# Altium schematic sheet PongBoy.SchDoc
size A4; CompanyName: HESSO; Address1: Route du Rawyl 47; Address2: 1950 Sion; Address3: Switzerland; PageSetup: Record=PageOptions|CenterHorizontal=True|CenterVertical=True|PrintScale=1.00|XCorrection=1.00|YCorrection=1.00|PrintKind=1|BorderSize=5000000|LeftOffset=0|BottomOffset=0|Orientation=2|PaperLength=1000|PaperWidth=1000|Scale=100|PaperSource=15|PrintQuality=1200|MediaType=1|DitherType=10|PrintScaleMode=1|PaperKind=A4|PaperIndex=9; ProjectName: Project Name
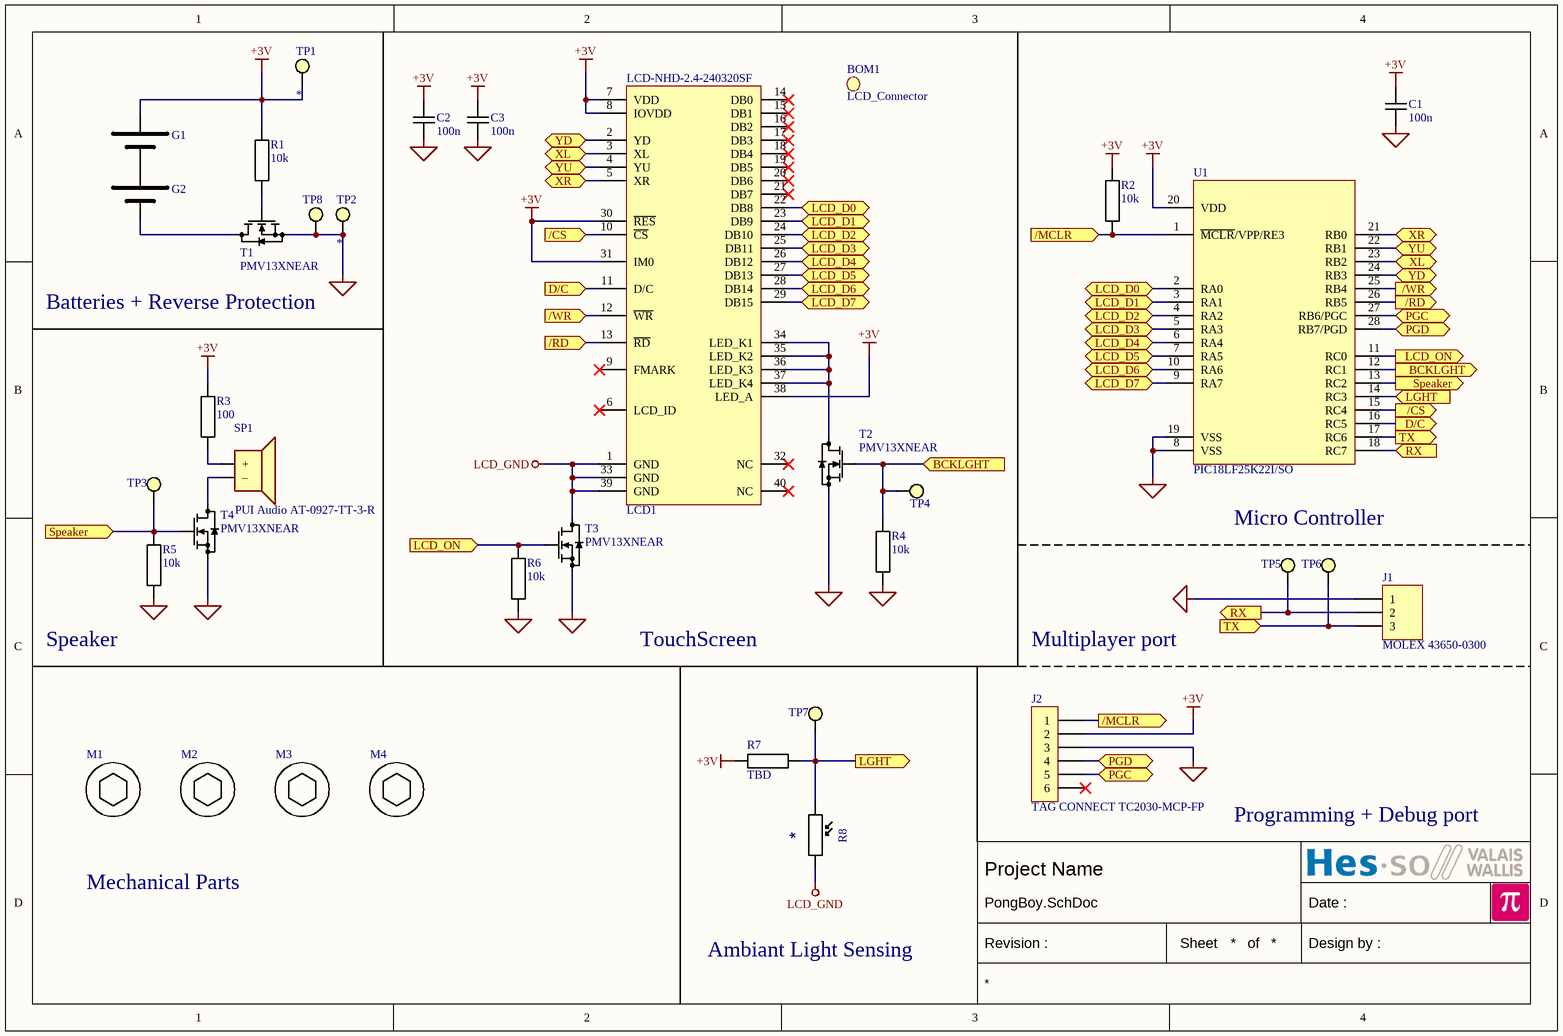
[diagram p0: PongBoy.SchDoc]

## Parts
BOM1  LCD_Connector
C1  100n  [CAPACITOR 2012 REFLOW]
C2  100n  [CAPACITOR 2012 REFLOW]
C3  100n  [CAPACITOR 2012 REFLOW]
G1  AAA Battery Holder  [1.5V Cell AAA/LR03]  (value not drawn)
G2  AAA Battery Holder  [1.5V Cell AAA/LR03]  (value not drawn)
J1  MOLEX 43650-0300  [MOLEX 43650-0300]
J2  TAG CONNECT TC2030-MCP-FP  [TAG CONNECT TC2030-MCP-FP]
LCD1  LCD-NHD-2.4-240320SF  [LCD-NHD-2.4-240320SF]
M1  M3x20  [Screw Hex Socket M3X5 Unconnected]  (value not drawn)
M2  M3x20  [Screw Hex Socket M3X5 Unconnected]  (value not drawn)
M3  M3x20  [Screw Hex Socket M3X5 Unconnected]  (value not drawn)
M4  M3x20  [Screw Hex Socket M3X5 Unconnected]  (value not drawn)
R1  10k  [RESISTOR 2012 REFLOW]
R2  10k  [RESISTOR 2012 REFLOW]
R3  100  [RESISTOR 2012 REFLOW]
R4  10k  [RESISTOR 2012 REFLOW]
R5  10k  [RESISTOR 2012 REFLOW]
R6  10k  [RESISTOR 2012 REFLOW]
R7  TBD  [RESISTOR 2012 REFLOW]
R8  *  [LDR VT900]
SP1  PUI Audio AT-0927-TT-3-R  [Speaker PUI Audio AT-0927-TT-3-R]
T1  PMV13XNEAR  [SOT23 P0.95 C1.6x3.0 H1.3]
T2  PMV13XNEAR  [SOT23 P0.95 C1.6x3.0 H1.3]
T3  PMV13XNEAR  [SOT23 P0.95 C1.6x3.0 H1.3]
T4  PMV13XNEAR  [SOT23 P0.95 C1.6x3.0 H1.3]
TP1  *  [Pad D2.0]  (no BOM)
TP2  *  [Pad D2.0]  (no BOM)
TP3  *  [Test Point Vogt 1016L.68M]  (value not drawn)
TP4  *  [Test Point Vogt 1016L.68M]  (value not drawn)
TP5  *  [Test Point Vogt 1016L.68M]  (value not drawn)
TP6  *  [Test Point Vogt 1016L.68M]  (value not drawn)
TP7  *  [Test Point Vogt 1016L.68M]  (value not drawn)
TP8  *  [Test Point Vogt 1016L.68M]  (value not drawn)
U1  PIC18LF25K22I/SO  [SO28 P1.27 C7.5X17.9 H2.7]

## Ports
/CS (in), /CS (out), /MCLR (in), /MCLR (out), /RD (in), /RD (out), /WR (in), /WR (out), BCKLGHT (in), BCKLGHT (out), D/C (in), D/C (out), LCD_D0 (bidir), LCD_D1 (bidir), LCD_D2 (bidir), LCD_D3 (bidir), LCD_D4 (bidir), LCD_D5 (bidir), LCD_D6 (bidir), LCD_D7 (bidir), LCD_ON (in), LCD_ON (out), LGHT (in), LGHT (out), PGC (bidir), PGD (bidir), RX (in), RX (out), Speaker (in), Speaker (out), TX (in), TX (out), XL (bidir), XR (bidir), YD (bidir), YU (bidir)

## Nets
+3V: C1.2 C2.2 C3.2 G1.1(+) J2.2 LCD1.7(VDD) LCD1.8(IOVDD) LCD1.30(~{RES}) LCD1.31(IM0) LCD1.38(LED_A) R1.2 R2.2 R3.2 R7.2 TP1.1 U1.20(VDD)
GND: C1.1 C2.1 C3.1 J1.1 J2.3 R4.1 R5.1 R6.1 T1.2(S) T2.2(S) T3.2(S) T4.2(S) TP2.1 TP8.1 U1.8(VSS) U1.19(VSS)
LCD_GND: LCD1.1(GND) LCD1.33(GND) LCD1.39(GND) R8.2 T3.3(D)
/CS: LCD1.10(~{CS}) U1.15(RC4) ; port /CS
/MCLR: J2.1 R2.1 U1.1(~{MCLR}/VPP/RE3) ; port /MCLR
/RD: LCD1.13(~{RD}) U1.26(RB5) ; port /RD
/WR: LCD1.12(~{WR}) U1.25(RB4) ; port /WR
BCKLGHT: R4.2 T2.1(G) TP4.1 U1.12(RC1) ; port BCKLGHT
D/C: LCD1.11(D/C) U1.16(RC5) ; port D/C
LCD_D0: LCD1.22(DB8) U1.2(RA0) ; port LCD_D0
LCD_D1: LCD1.23(DB9) U1.3(RA1) ; port LCD_D1
LCD_D2: LCD1.24(DB10) U1.4(RA2) ; port LCD_D2
LCD_D3: LCD1.25(DB11) U1.5(RA3) ; port LCD_D3
LCD_D4: LCD1.26(DB12) U1.6(RA4) ; port LCD_D4
LCD_D5: LCD1.27(DB13) U1.7(RA5) ; port LCD_D5
LCD_D6: LCD1.28(DB14) U1.10(RA6) ; port LCD_D6
LCD_D7: LCD1.29(DB15) U1.9(RA7) ; port LCD_D7
LCD_ON: R6.2 T3.1(G) U1.11(RC0) ; port LCD_ON
LGHT: R7.1 R8.1 TP7.1 U1.14(RC3) ; port LGHT
PGC: J2.5 U1.27(RB6/PGC) ; port PGC
PGD: J2.4 U1.28(RB7/PGD) ; port PGD
RX: J1.2 TP5.1 U1.18(RC7) ; port RX
Speaker: R5.2 T4.1(G) TP3.1 U1.13(RC2) ; port Speaker
TX: J1.3 TP6.1 U1.17(RC6) ; port TX
XL: LCD1.3(XL) U1.23(RB2) ; port XL
XR: LCD1.5(XR) U1.21(RB0) ; port XR
YD: LCD1.2(YD) U1.24(RB3) ; port YD
YU: LCD1.4(YU) U1.22(RB1) ; port YU
NetG1_2: G1.2(—) G2.1(+)
NetG2_2: G2.2(—) T1.3(D)
NetLCD1_34: LCD1.34(LED_K1) LCD1.35(LED_K2) LCD1.36(LED_K3) LCD1.37(LED_K4) T2.3(D)
NetR1_1: R1.1 T1.1(G)
NetR3_1: R3.1 SP1.1(+)
NetSP1_2: SP1.2(–) T4.3(D)

Not connected (* = marked no-connect by the designer): J2 6*; LCD1 6(LCD_ID)* 9(FMARK)* 14(DB0)* 15(DB1)* 16(DB2)* 17(DB3)* 18(DB4)* 19(DB5)* 20(DB6)* 21(DB7)* 32(NC)* 40(NC)*

## Notes on the sheet
- Batteries + Reverse Protection
- Micro Controller
- (near R5) Speaker
- TouchScreen
- Multiplayer port
- Programming + Debug port
- Mechanical Parts
- Ambiant Light Sensing
- Date :
- Revision :
- Sheet
- of
- Design by :

## Library data of the parts
BOM1 = Additional BOM Entry: Component without pattern; Value: LCD_Connector
C1-C3 = Capacitor: Value: 100n
G1 G2 = Battery: Battery Generic; Value: AAA Battery Holder
J1 = MOLEX 43650-0300: Micro-Fit 3.0 Right-Angle Header, 3.00mm Pitch, Single Row, 3 Circuits
LCD1 = LCD-NHD-2.4-240320SF: NEWHEAVEN LCD; Value: LCD-NHD-2.4-240320SF
M1-M4 = Screw Hex Socket Unconnected: Screw Hex Socket Unconnected BN610; Value: M3x20
R1-R7 = Resistor
  R1 R2 R4-R6: Value: 10k
  R3: Value: 100
  R7: Value: TBD
R8 = LDR: Light Dependent Resistor; Value: *
SP1 = Speaker PUI Audio AT-0927-TT-3-R: Value: PUI Audio AT-0927-TT-3-R
T1-T4 = MOS-N SOT23 G-S-D: Generic MOS-N; Value: PMV13XNEAR
TP1 TP2 = Pad: Value: *
TP3-TP8 = Test Point: Value: *
U1 = PIC18F2_K22-_/SO: Flash Microcontrollers  with 10-Bit A/D and nanoWatt Technology; Value: PIC18LF25K22I/SO